# EAGLE design adc_small (EAGLE 5.11)
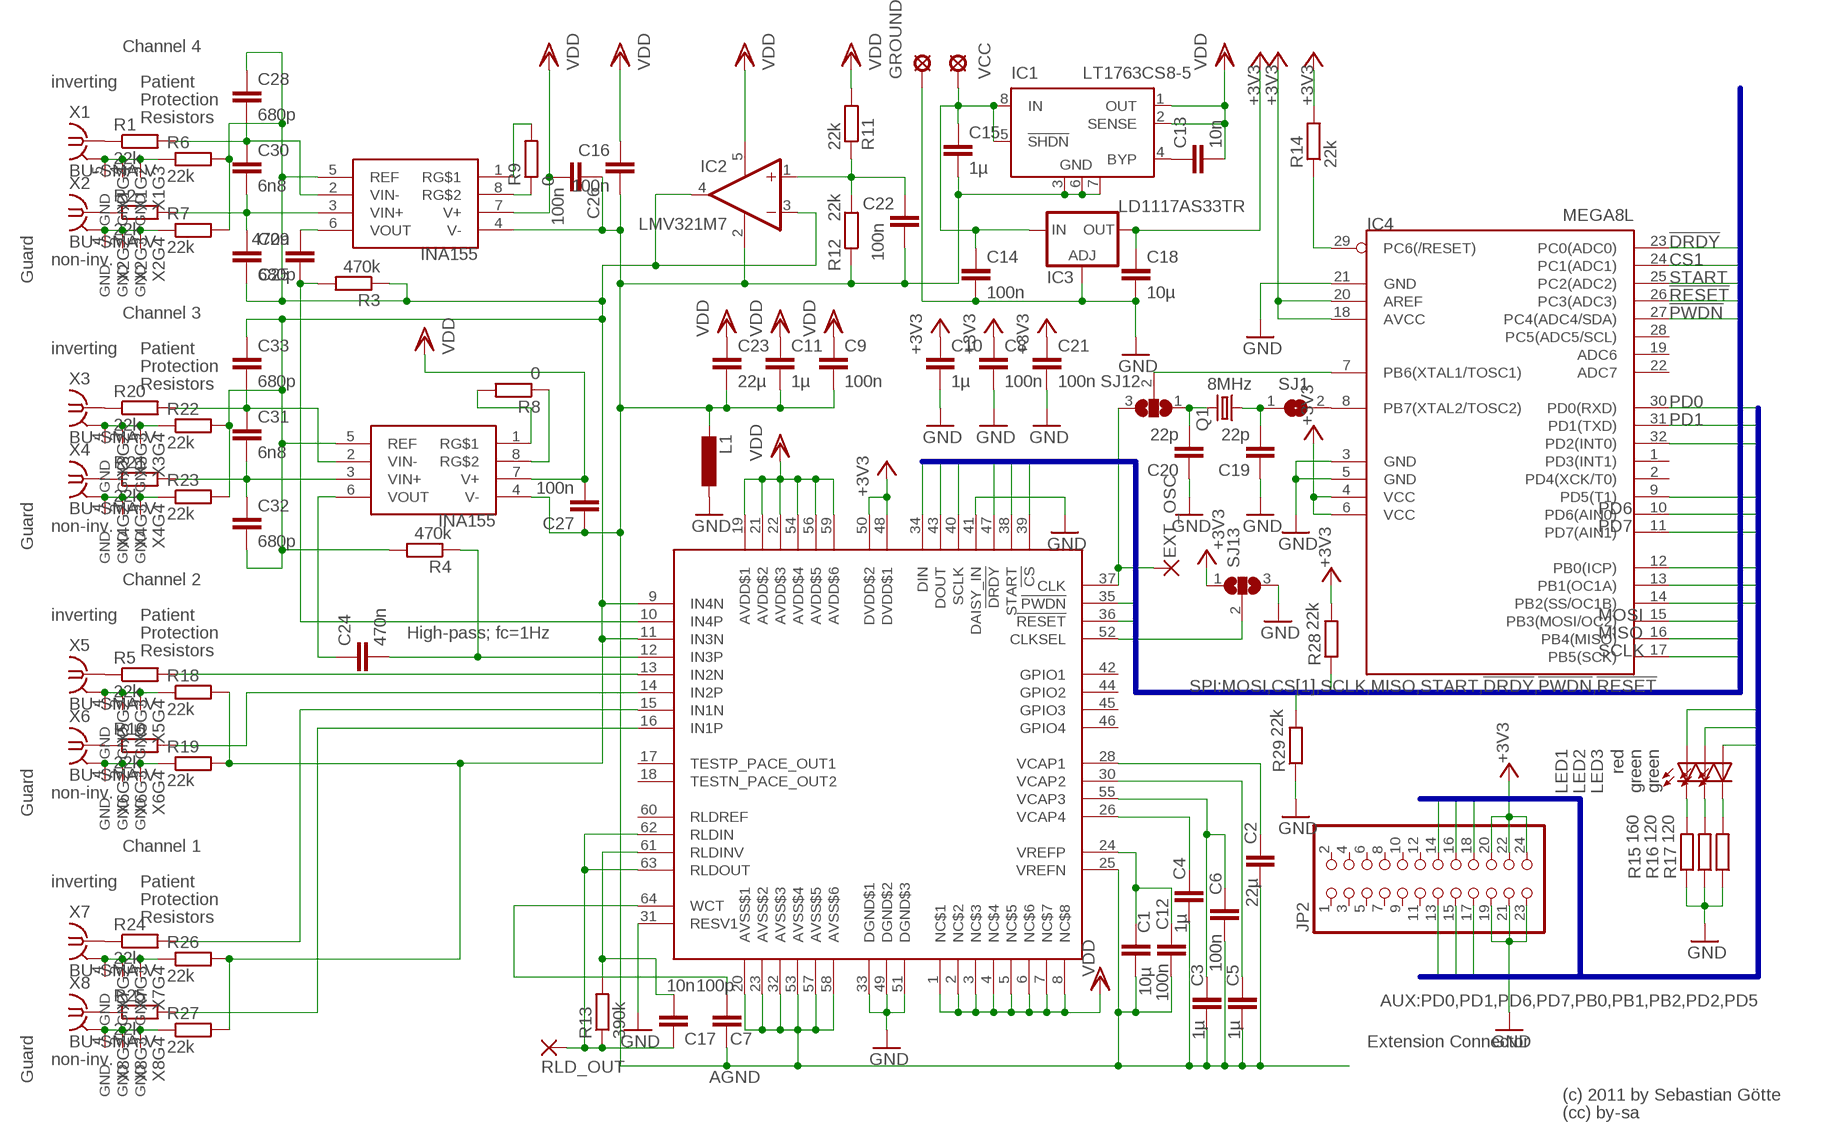
[diagram p0: schematic, sheet 1]

## Parts
C1  10µ  C-EUC0805K  [C0805K]
C2  22µ  C-EUC1206  [C1206]
C3  1µ  C-EUC0805K  [C0805K]
C4  1µ  C-EUC0805K  [C0805K]
C5  1µ  C-EUC0805K  [C0805K]
C6  100n  C-EUC0805K  [C0805K]
C7  100p  C-EUC0805K  [C0805K]
C8  100n  C-EUC0805K  [C0805K]
C9  100n  C-EUC0805K  [C0805K]
C10  1µ  C-EUC0805  [C0805]
C11  1µ  C-EUC0805K  [C0805K]
C12  100n  C-EUC0805K  [C0805K]
C13  10n  C-EUC0805K  [C0805K]
C14  100n  C-EUC0805K  [C0805K]
C15  1µ  C-EUC0805K  [C0805K]
C16  100n  C-EUC0805  [C0805]
C17  10n  C-EUC0805K  [C0805K]
C18  10µ  C-EUC0805K  [C0805K]
C19  22p  C-EUC0805K  [C0805K]
C20  22p  C-EUC0805K  [C0805K]
C21  100n  C-EUC0805K  [C0805K]
C22  100n  C-EUC0805  [C0805]
C23  22µ  C-EUC1206  [C1206]
C24  470n  C-EUC0805K  [C0805K]
C25  470n  C-EUC0805K  [C0805K]
C26  100n  C-EUC0805K  [C0805K]
C27  100n  C-EUC0805K  [C0805K]
C28  680p  C-EUC0805  [C0805]
C29  680p  C-EUC0805  [C0805]
C30  6n8  C-EUC0805  [C0805]
C31  6n8  C-EUC0805  [C0805]
C32  680p  C-EUC0805  [C0805]
C33  680p  C-EUC0805  [C0805]
EXT_OSC  1,6/0,8  [1,6/0,8]
GROUND  MCS10B  [MCS10B]
IC1  LT1763CS8-5  LT1763CS8-3.3  [SOIC8]
IC2  LMV321M7  [SC70-5L]
IC3  LD1117AS33TR  LD117AS33TR  [SOT223]
IC4  MEGA8L  MEGA8-AI  [TQFP32-08]
JP2  PINHD-2X12  [2X12]
L1  L-EUPIS2816  [PIS2816]
LED1  red  LEDCHIPLED_1206  [CHIPLED_1206]
LED2  green  LEDCHIPLED_1206  [CHIPLED_1206]
LED3  green  LEDCHIPLED_1206  [CHIPLED_1206]
Q1  8MHz  CRYSTALHC49UP  [HC49UP]
R1  22k  R-EU_R1206  [R1206]
R2  22k  R-EU_R1206  [R1206]
R3  470k  R-EU_R1206  [R1206]
R4  470k  R-EU_R1206  [R1206]
R5  22k  R-EU_R1206  [R1206]
R6  22k  R-EU_R1206  [R1206]
R7  22k  R-EU_R1206  [R1206]
R8  0  R-EU_R1206  [R1206]
R9  0  R-EU_R1206  [R1206]
R10  22k  R-EU_R1206  [R1206]
R11  22k  R-EU_R1206  [R1206]
R12  22k  R-EU_R1206  [R1206]
R13  390k  R-EU_M0805  [M0805]
R14  22k  R-EU_R1206  [R1206]
R15  160  R-EU_R1206  [R1206]
R16  120  R-EU_R1206  [R1206]
R17  120  R-EU_R1206  [R1206]
R18  22k  R-EU_R1206  [R1206]
R19  22k  R-EU_R1206  [R1206]
R20  22k  R-EU_R1206  [R1206]
R21  22k  R-EU_R1206  [R1206]
R22  22k  R-EU_R1206  [R1206]
R23  22k  R-EU_R1206  [R1206]
R24  22k  R-EU_R1206  [R1206]
R25  22k  R-EU_R1206  [R1206]
R26  22k  R-EU_R1206  [R1206]
R27  22k  R-EU_R1206  [R1206]
R28  22k  R-EU_R1206  [R1206]
R29  22k  R-EU_R1206  [R1206]
RLD_OUT  2,54/1,0  [2,54/1,0]
SJ1  SJ  [SJ]
SJ12  SJ2W  [SJ_2]
SJ13  SJ2W  [SJ_2]
U$1  ADS1194  [TQFP-64]
U$2  INA155  [SO-08]
U$3  INA155  [SO-08]
VCC  MCS10B  [MCS10B]
X1  BU-SMA-V  [BU-SMA-V]
X2  BU-SMA-V  [BU-SMA-V]
X3  BU-SMA-V  [BU-SMA-V]
X4  BU-SMA-V  [BU-SMA-V]
X5  BU-SMA-V  [BU-SMA-V]
X6  BU-SMA-V  [BU-SMA-V]
X7  BU-SMA-V  [BU-SMA-V]
X8  BU-SMA-V  [BU-SMA-V]

## Nets
!DRDY: IC4.23(PC0(ADC0)) U$1.47(!DRDY)
!PWDN: IC4.27(PC4(ADC4/SDA)) U$1.35(!PWDN)
!RESET: IC4.26(PC3(ADC3)) R29.2 U$1.36(!RESET)
+3V3: C8.1 C10.1 C18.1 C21.1 IC3.4(OUT) IC4.4(VCC) IC4.6(VCC) IC4.18(AVCC) IC4.20(AREF) JP2.20 JP2.22 JP2.24 R14.2 R28.2 SJ13.1 U$1.48(DVDD$1) U$1.50(DVDD$2)
CLK: EXT_OSC.1(P) SJ12.3 U$1.37(CLK)
CLKSEL: SJ13.2 U$1.52(CLKSEL)
CS1: IC4.24(PC1(ADC1)) R28.1 U$1.39(!CS)
MISO: IC4.16(PB4(MISO)) U$1.43(DOUT)
MOSI: IC4.15(PB3(MOSI/OC2)) U$1.34(DIN)
N$1: C2.1 U$1.28(VCAP1)
N$2: C4.1 U$1.26(VCAP4)
N$3: C7.2 U$1.64(WCT)
N$4: C5.1 U$1.30(VCAP2)
N$5: C3.1 C6.1 U$1.55(VCAP3)
N$6: C1.1 C12.1 U$1.24(VREFP)
N$7: R9.1 U$2.8(RG$2)
N$9: C25.1 R3.2 U$1.10(IN4P)
N$10: C28.1 C29.2 C32.2 C33.1 IC2.3(-IN) IC2.4(OUT) R3.1 R4.2 R6.2 R7.2 R18.2 R19.2 R22.2 R23.2 R26.2 R27.2 U$1.9(IN4N) U$1.11(IN3N) U$2.5(REF) U$3.5(REF)
N$11: R5.2 U$1.13(IN2N)
N$12: C29.1 C30.2 R2.2 U$2.3(VIN+)
N$13: C28.2 C30.1 R1.2 U$2.2(VIN-)
N$14: R1.1 X1.1
N$15: R2.1 X2.1
N$16: C13.1 IC1.4(BYP)
N$17: R20.1 X3.1
N$18: R21.1 X4.1
N$19: R9.2 U$2.1(RG$1)
N$20: R8.1 U$3.8(RG$2)
N$21: R19.1 X6.2(GND) X6.3(GND) X6.4(GND) X6.5(GND)
N$22: R18.1 X5.2(GND) X5.3(GND) X5.4(GND) X5.5(GND)
N$23: R5.1 X5.1
N$24: R10.2 U$1.14(IN2P)
N$25: R8.2 U$3.1(RG$1)
N$26: C24.1 U$3.6(VOUT)
N$27: R10.1 X6.1
N$28: C31.1 C33.2 R20.2 U$3.2(VIN-)
N$29: C31.2 C32.1 R21.2 U$3.3(VIN+)
N$30: R7.1 X2.2(GND) X2.3(GND) X2.4(GND) X2.5(GND)
N$31: R6.1 X1.2(GND) X1.3(GND) X1.4(GND) X1.5(GND)
N$32: C24.2 R4.1 U$1.12(IN3P)
N$33: C1.2 C2.2 C3.2 C4.2 C5.2 C6.2 C7.1 C9.2 C11.2 C12.2 C15.2 C16.2 C22.2 C23.2 C26.1 C27.1 IC1.3(GND) IC1.6(GND) IC1.7(GND) IC2.2(V-) L1.2 R12.1 U$1.20(AVSS$1) U$1.23(AVSS$2) U$1.25(VREFN) U$1.32(AVSS$3) U$1.53(AVSS$4) U$1.57(AVSS$5) U$1.58(AVSS$6) U$2.4(V-) U$3.4(V-)
N$34: C17.2 R13.2 U$1.61(RLDINV)
N$35: C20.2 Q1.2 SJ12.1
N$36: R24.2 U$1.15(IN1N)
N$37: R25.2 U$1.16(IN1P)
N$38: C19.2 Q1.1 SJ1.1
N$39: C8.2 C10.2 C14.2 C18.2 C19.1 C20.1 C21.2 GROUND.MP IC3.1(ADJ) IC4.3(GND) IC4.5(GND) IC4.21(GND) JP2.19 JP2.21 JP2.23 L1.1 R15.1 R16.1 R17.1 R29.1 SJ13.3 U$1.31(RESV1) U$1.33(DGND$1) U$1.41(DAISY_IN) U$1.49(DGND$2) U$1.51(DGND$3) ; supply symbol labelled GND
N$40: IC4.7(PB6(XTAL1/TOSC1)) SJ12.2
N$44: LED1.C R15.2
N$45: LED2.C R16.2
N$46: LED3.C R17.2
N$48: IC4.8(PB7(XTAL2/TOSC2)) SJ1.2
N$57: C25.2 U$2.6(VOUT)
N$58: R23.1 X4.2(GND) X4.3(GND) X4.4(GND) X4.5(GND)
N$59: R22.1 X3.2(GND) X3.3(GND) X3.4(GND) X3.5(GND)
N$60: R24.1 X7.1
N$63: R25.1 X8.1
N$65: R27.1 X8.2(GND) X8.3(GND) X8.4(GND) X8.5(GND)
N$66: R26.1 X7.2(GND) X7.3(GND) X7.4(GND) X7.5(GND)
PB0: IC4.12(PB0(ICP)) LED1.A
PB1: IC4.13(PB1(OC1A)) LED3.A
PB2: IC4.14(PB2(SS/OC1B)) LED2.A
PD0: IC4.30(PD0(RXD)) JP2.16
PD1: IC4.31(PD1(TXD)) JP2.17
PD2: IC4.32(PD2(INT0)) JP2.18
PD5: IC4.9(PD5(T1)) JP2.15
PD6: IC4.10(PD6(AIN0)) JP2.14
PD7: IC4.11(PD7(AIN1)) JP2.13
REF_NODE: C22.1 IC2.1(+IN) R11.1 R12.2
RLD_OUT: C17.1 R13.1 RLD_OUT.1(P) U$1.62(RLDIN) U$1.63(RLDOUT)
SCLK: IC4.17(PB5(SCK)) U$1.40(SCLK)
START: IC4.25(PC2(ADC2)) U$1.38(START)
UCRESET: IC4.29(PC6(/RESET)) R14.1
VCC_IN: C14.1 C15.1 IC1.5(!SHDN) IC1.8(IN) IC3.3(IN) VCC.MP
VDD: C9.1 C11.1 C13.2 C16.1 C23.1 C26.2 C27.2 IC1.1(OUT) IC1.2(SENSE) IC2.5(V+) R11.2 U$1.1(NC$1) U$1.2(NC$2) U$1.3(NC$3) U$1.4(NC$4) U$1.5(NC$5) U$1.6(NC$6) U$1.7(NC$7) U$1.8(NC$8) U$1.19(AVDD$1) U$1.21(AVDD$2) U$1.22(AVDD$3) U$1.54(AVDD$4) U$1.56(AVDD$5) U$1.59(AVDD$6) U$2.7(V+) U$3.7(V+)
Unconnected: IC4.1(PD3(INT1)) IC4.2(PD4(XCK/T0)) IC4.19(ADC6) IC4.22(ADC7) IC4.28(PC5(ADC5/SCL)) JP2.1 JP2.2 JP2.3 JP2.4 JP2.5 JP2.6 JP2.7 JP2.8 JP2.9 JP2.10 JP2.11 JP2.12 U$1.17(TESTP_PACE_OUT1) U$1.18(TESTN_PACE_OUT2) U$1.42(GPIO1) U$1.44(GPIO2) U$1.45(GPIO3) U$1.46(GPIO4) U$1.60(RLDREF)

## Buses
SPI:MOSI,CS[1],SCLK,MISO,START,!DRDY,!PWDN,!RESET
AUX:PD0,PD1,PD6,PD7,PB0,PB1,PB2,PD2,PD5

## Notes on the sheet
- Channel 4
- inverting | Patient
- Protection
- Resistors
- INA155
- non-inv.
- Guard
- Channel 3
- inverting | Patient
- Protection
- Resistors
- INA155
- non-inv.
- Guard
- Channel 2
- inverting | Patient
- Protection | High-pass; fc=1Hz
- Resistors
- non-inv.
- Guard
- Channel 1
- inverting | Patient
- Protection
- Resistors
- Extension Connector
- non-inv.
- Guard | AGND
- (c) 2011 by Sebastian Götte
- (cc) by-sa

## Library data of the parts
C1-C33 = rcl:C-EU: CAPACITOR, European symbol
EXT_OSC = wirepad:1,6/0,8: THROUGH-HOLE PAD
GROUND VCC = solpad:MCS10B: SOLDER PAD MC S1, distributor Buerklin, 15F505
IC1 = linear-technology:LT1763CS8: 500mA, Low Noise, LDO Micropower Regulators Source: http://cds.linear.com/docs/Datasheet/1763ff.pdf; MPN: LT1763CS8-3.3; OC_FARNELL: 1273617; OC_NEWARK: 57M6055
IC2 = linear:LMV321?*: General Purpose, Low Voltage, Rail-to-Rail Output Operational Amplifiers Source: http://www.national.com/mpf/LM/LMV321.html http://www.national.com/dt/lmv_qual.pdf
IC3 = v-reg:LD117A?*: Low drop fixed and adjustable positive voltage regulators 1 A Source: http://www.st.com/stonline/products/literature/ds/7194/ld1117axx.pdf
IC4 = atmel:MEGA8: MICROCONTROLLER 8 Kbytes FLASH, 1 kbytes SRAM, 512 bytes EEPROM, USART, 6-channel 10 bit ADC, 2-channel 8 bit ADC Pin compatible with Atmega48, ATMega88, ATMega168 Source: avr.lbr; MPN: ATMEGA8-16AU; OC_FARNELL: 9171371; OC_NEWARK: 73M8863
JP2 = pinhead:PINHD-2X12: PIN HEADER
L1 = rcl:L-EU: INDUCTOR, European symbol
LED1-LED3 = led:LED: LED OSRAM: - CHIPLED LG R971, LG N971, LY N971, LG Q971, LY Q971, LO R971, LY R971 LH N974, LH R974 LS Q976, LO Q976, LY Q976 LO Q996 - Hyper CHIPLED LW Q18S LB Q993, LB Q99A, LB R99A - SideLED LS A670, LO A670, LY A670, LG A670, LP A670 LB A673, LV A673, LT A673, LW A673 LH A674 LY A675 LS A676, LA A676, LO A676, LY A676, LW A676 LS A679, LY A679, LG A679 - Hyper Micro SIDELED® LS Y876, LA Y876, LO Y876, LY Y876 LT Y87S - SmartLED LW L88C, LW L88S LB L89C, LB L89S, LG L890 LS L89K, LO L89K, LY L89K LS L896, LA L896, LO L896, LY L896 - TOPLED LS T670, LO T670, LY T670, LG T670, LP T670 LSG T670, LSP T670, LSY T670, LOP T670, LYG T670 LG T671, LOG T671, LSG T671 LB T673, LV T673, LT T673, LW T673 LH T674 LS T676, LA T676, LO T676, LY T676, LB T676, LH T676, LSB T676, LW T676 LB T67C, LV T67C, LT T67C, LS T67K, LO T67K, LY T67K, LW E67C LS E67B, LA E67B, LO E67B, LY E67B, LB E67C, LV E67C, LT E67C LW T67C LS T679, LY T679, LG T679 LS T770, LO T770, LY T770, LG T770, LP T770 LB T773, LV T773, LT T773, LW T773 LH T774 LS E675, LA E675, LY E675, LS T675 LS T776, LA T776, LO T776, LY T776, LB T776 LHGB T686 LT T68C, LB T68C - Hyper Mini TOPLED® LB M676 - Mini TOPLED Santana® LG M470 LS M47K, LO M47K, LY M47K Source: http://www.osram.convergy.de LUXEON: - LUMILED® LXK2-PW12-R00, LXK2-PW12-S00, LXK2-PW14-U00, LXK2-PW14-V00 LXK2-PM12-R00, LXK2-PM12-S00, LXK2-PM14-U00 LXK2-PE12-Q00, LXK2-PE12-R00, LXK2-PE12-S00, LXK2-PE14-T00, LXK2-PE14-U00 LXK2-PB12-K00, LXK2-PB12-L00, LXK2-PB12-M00, LXK2-PB14-N00, LXK2-PB14-P00, LXK2-PB14-Q00 LXK2-PR12-L00, LXK2-PR12-M00, LXK2-PR14-Q00, LXK2-PR14-R00 LXK2-PD12-Q00, LXK2-PD12-R00, LXK2-PD12-S00 LXK2-PH12-R00, LXK2-PH12-S00 LXK2-PL12-P00, LXK2-PL12-Q00, LXK2-PL12-R00 Source: www.luxeon.com KINGBRIGHT: KA-3528ASYC Source: www.kingbright.com
Q1 = crystal:CRYSTAL: CRYSTAL; OC_FARNELL: unknown; OC_NEWARK: unknown
R1-R29 = rcl:R-EU_: RESISTOR, European symbol
RLD_OUT = wirepad:2,54/1,0: THROUGH-HOLE PAD
SJ1 = jumper:SJ: SMD solder JUMPER
SJ12 SJ13 = jumper:SJ2W: SMD solder JUMPER
U$1 = mytexas:ADS1194: Low-Power, 8-Channel, 16-Bit Analog Front-End for Biopotential Measurements for ECG/EEG applications
U$2 U$3 = mytexas:INA155: Single-Supply, Rail-to-Rail Output, CMOS INSTRUMENTATION AMPLIFIER
X1-X8 = con-coax:BU-SMA-V: FEMALE SMA CONNECTOR Radiall distributor RS 112-3794; OC_FARNELL: unknown; OC_NEWARK: unknown

## Board
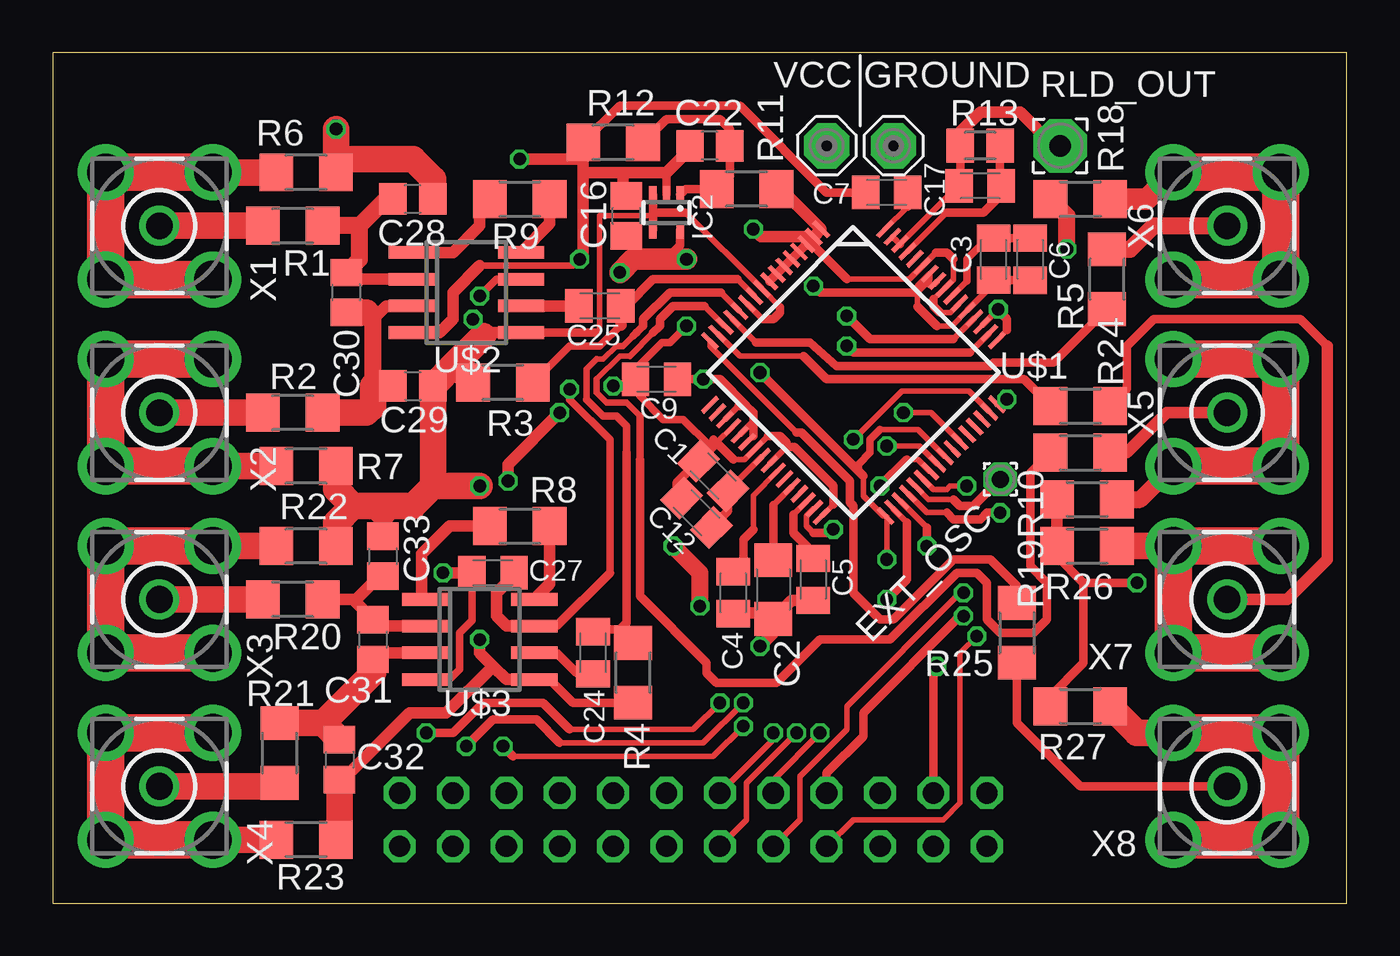
[diagram p1: board, top side]
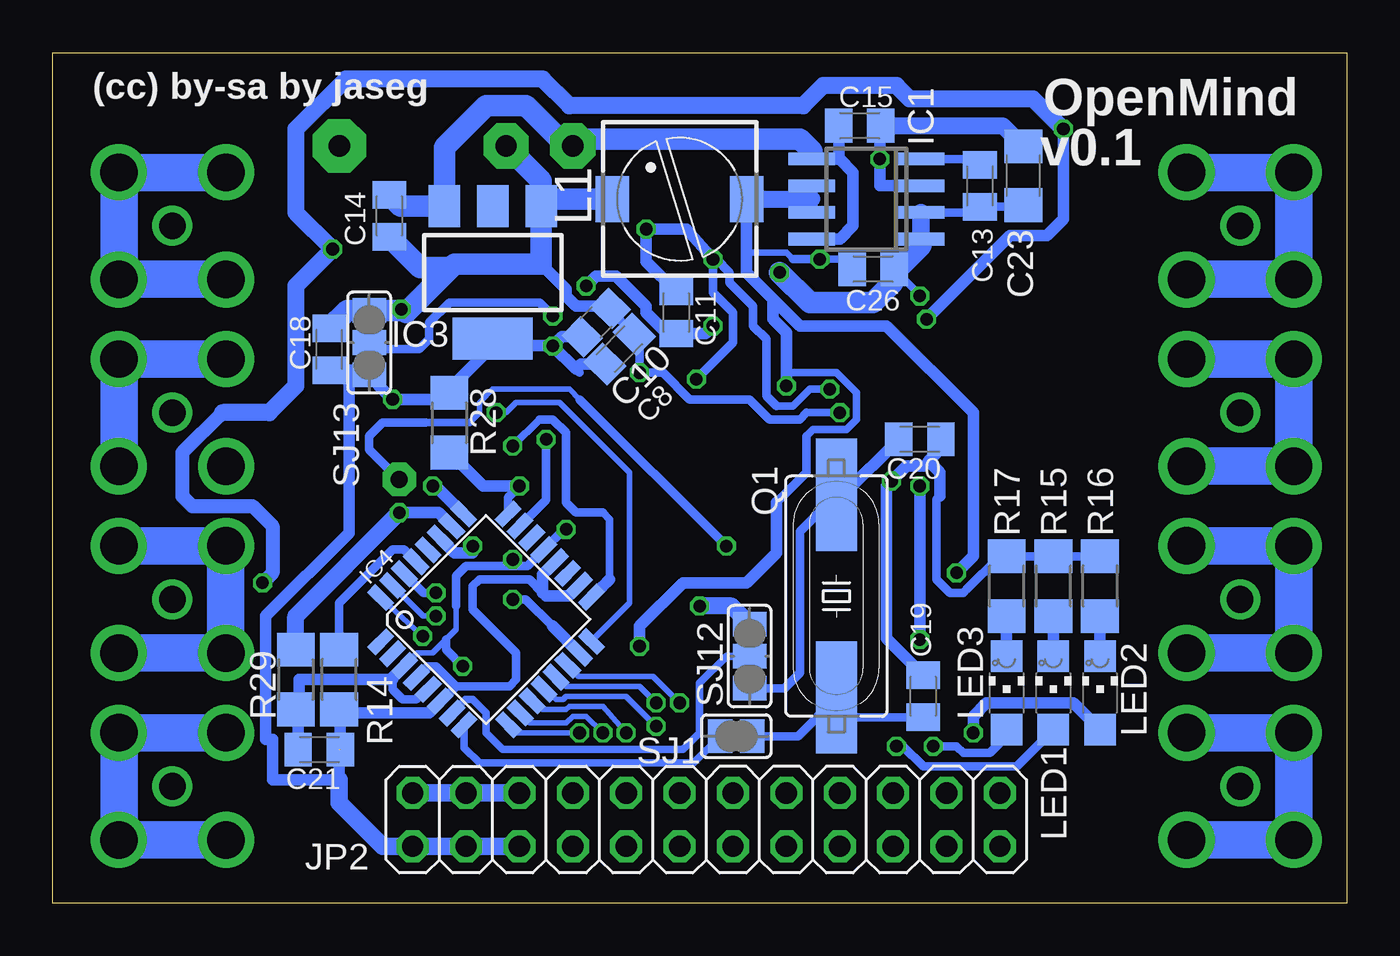
[diagram p2: board, bottom side, seen from below]

Size 61.58 x 40.47 mm. Coordinates in mm from the lower left corner, seen from the top.
Outline: 0,0 61.58,0 61.58,40.47 0,40.47 0,0
Copper layers (1*16): Top 0.035mm / dielectric 1.5mm / Bottom 0.035mm
Design rules "Fusion_eagle_rule_v1.1": minimum track width 6mil, minimum drill 12mil, track to track 6mil, track to pad 6mil, pad to pad 6mil, via to via 6mil, smd to smd 0mil, copper to edge 10mil, drill to drill 10mil, minimum pad ring 10mil, minimum via ring 6mil, stop-mask expansion 2mil, vias tented up to drill 100mil, thermal gap 10mil

### Footprints (pad centres in the part's own frame; a part is rotated, then mirrored left to right if it is on the bottom)
C0805K = smd 1.3 x 1.6: 1 -1,0; 2 1,0
C1206 = smd 1.6 x 1.8: 1 -1.4,0; 2 1.4,0
C0805 = smd 1.3 x 1.5: 1 -0.95,0; 2 0.95,0
1,6/0,8 = drill 0.813 pad 1.6 octagon: 1 0,0
MCS10B = drill 1.016 pad 2.159 octagon: MP 0,0
SOIC8 = smd 0.6 x 2.2: 1 -1.905,-2.6; 2 -0.635,-2.6; 3 0.635,-2.6; 4 1.905,-2.6; 5 1.905,2.6; 6 0.635,2.6; 7 -0.635,2.6; 8 -1.905,2.6
SC70-5L = smd 0.35 x 0.8: 1 -0.65,-0.85; 2 0,-0.85; 3 0.65,-0.85; 4 0.65,0.85; 5 -0.65,0.85
SOT223 = smd 1.5 x 2: 1 -2.3,-3.15; 2 0,-3.15; 3 2.3,-3.15 | smd 3.8 x 2: 4 0,3.15
TQFP32-08 = smd 1.27 x 0.559: 1 -4.293,2.8; 2 -4.293,2; 3 -4.293,1.2; 4 -4.293,0.4; 5 -4.293,-0.4; 6 -4.293,-1.2; 7 -4.293,-2; 8 -4.293,-2.8; 17 4.293,-2.8; 18 4.293,-2; 19 4.293,-1.2; 20 4.293,-0.4; 21 4.293,0.4; 22 4.293,1.2; 23 4.293,2; 24 4.293,2.8 | smd 0.559 x 1.27: 9 -2.8,-4.293; 10 -2,-4.293; 11 -1.2,-4.293; 12 -0.4,-4.293; 13 0.4,-4.293; 14 1.2,-4.293; 15 2,-4.293; 16 2.8,-4.293; 25 2.8,4.293; 26 2,4.293; 27 1.2,4.293; 28 0.4,4.293; 29 -0.4,4.293; 30 -1.2,4.293; 31 -2,4.293; 32 -2.8,4.293
2X12 = drill 1.016 octagon: 1 -13.97,-1.27; 2 -13.97,1.27; 3 -11.43,-1.27; 4 -11.43,1.27; 5 -8.89,-1.27; 6 -8.89,1.27; 7 -6.35,-1.27; 8 -6.35,1.27; 9 -3.81,-1.27; 10 -3.81,1.27; 11 -1.27,-1.27; 12 -1.27,1.27; 13 1.27,-1.27; 14 1.27,1.27; 15 3.81,-1.27; 16 3.81,1.27; 17 6.35,-1.27; 18 6.35,1.27; 19 8.89,-1.27; 20 8.89,1.27; 21 11.43,-1.27; 22 11.43,1.27; 23 13.97,-1.27; 24 13.97,1.27
PIS2816 = smd 2.2 x 1.6: 1 0,3.2; 2 0,-3.2
CHIPLED_1206 = smd 1.5 x 1.5: A 0,-1.75; C 0,1.75
HC49UP = smd 5.334 x 1.93: 1 -4.826,0; 2 4.826,0
R1206 = smd 1.6 x 1.803: 1 -1.422,0; 2 1.422,0
M0805 = smd 1.3 x 1.6: 1 -0.95,0; 2 0.95,0
2,54/1,0 = drill 1.016 pad 2.54 octagon: 1 0,0
SJ = smd 1.168 x 1.6: 1 -0.762,0; 2 0.762,0
SJ_2 = smd 1.168 x 1.6: 1 -1.524,0; 2 0,0; 3 1.524,0
TQFP-64 = smd 1 x 0.22: 1 -5.9,3.75; 2 -5.9,3.25; 3 -5.9,2.75; 4 -5.9,2.25; 5 -5.9,1.75; 6 -5.9,1.25; 7 -5.9,0.75; 8 -5.9,0.25; 9 -5.9,-0.25; 10 -5.9,-0.75; 11 -5.9,-1.25; 12 -5.9,-1.75; 13 -5.9,-2.25; 14 -5.9,-2.75; 15 -5.9,-3.25; 16 -5.9,-3.75; 33 5.9,-3.75; 34 5.9,-3.25; 35 5.9,-2.75; 36 5.9,-2.25; 37 5.9,-1.75; 38 5.9,-1.25; 39 5.9,-0.75; 40 5.9,-0.25; 41 5.9,0.25; 42 5.9,0.75; 43 5.9,1.25; 44 5.9,1.75; 45 5.9,2.25; 46 5.9,2.75; 47 5.9,3.25; 48 5.9,3.75 | smd 0.22 x 1: 17 -3.75,-5.9; 18 -3.25,-5.9; 19 -2.75,-5.9; 20 -2.25,-5.9; 21 -1.75,-5.9; 22 -1.25,-5.9; 23 -0.75,-5.9; 24 -0.25,-5.9; 25 0.25,-5.9; 26 0.75,-5.9; 27 1.25,-5.9; 28 1.75,-5.9; 29 2.25,-5.9; 30 2.75,-5.9; 31 3.25,-5.9; 32 3.75,-5.9; 49 3.75,5.9; 50 3.25,5.9; 51 2.75,5.9; 52 2.25,5.9; 53 1.75,5.9; 54 1.25,5.9; 55 0.75,5.9; 56 0.25,5.9; 57 -0.25,5.9; 58 -0.75,5.9; 59 -1.25,5.9; 60 -1.75,5.9; 61 -2.25,5.9; 62 -2.75,5.9; 63 -3.25,5.9; 64 -3.75,5.9
SO-08 = smd 0.6 x 2.2: 1 -1.905,-2.6; 2 -0.635,-2.6; 3 0.635,-2.6; 4 1.905,-2.6; 5 1.905,2.6; 6 0.635,2.6; 7 -0.635,2.6; 8 -1.905,2.6
BU-SMA-V = drill 1.27 round: 1 0,0 | drill 1.778 round: 2 -2.55,2.55; 3 2.55,2.55; 4 2.55,-2.55; 5 -2.55,-2.55

### Placement (x,y rotation side)
C1  31.43,20.32 135 top
C2  34.29,14.92 270 top
C3  44.77,30.64 270 top
C4  32.38,14.76 270 top
C5  36.2,15.4 270 top
C6  46.51,30.64 270 top
C7  39.69,33.81 0 top
C8  34.61,26.35 45.4 bottom
C9  28.73,24.92 180 top
C10  35.72,27.62 45.3 bottom
C11  31.91,28.1 270 bottom
C12  30.64,18.57 135 top
C13  17.46,34.13 270 bottom
C14  45.56,32.7 270 bottom
C15  23.18,36.99 0 bottom
C16  27.3,32.7 90 top
C17  44.13,34.13 0 top
C18  48.42,26.35 90 bottom
C19  20.16,9.84 270 bottom
C20  20.32,22.07 180 bottom
C21  48.9,7.3 180 bottom
C22  31.27,36.04 180 top
C23  15.4,34.61 90 bottom
C24  25.72,11.91 90 top
C25  26.04,28.42 180 top
C26  22.54,30.16 0 bottom
C27  20.95,15.72 0 top
C28  17.14,33.5 180 top
C29  17.14,24.61 0 top
C30  13.97,29.05 270 top
C31  15.24,12.54 270 top
C32  13.65,6.83 270 top
C33  15.72,16.51 270 top
EXT_OSC  45.09,20.16 0 top
GROUND  40.01,36.04 0 top
IC1  22.86,33.5 90 bottom
IC2  29.21,32.86 180 top
IC3  40.64,30 180 bottom
IC4  40.96,13.49 45.1 bottom
JP2  30.48,3.97 180 bottom
L1  31.75,33.5 90 bottom
LED1  13.97,10 0 bottom
LED2  11.75,10 0 bottom
LED3  16.19,10 0 bottom
Q1  24.29,14.61 90 bottom
R1  11.43,32.23 0 top
R2  11.43,23.34 0 top
R3  21.43,24.77 0 top
R4  27.62,10.95 270 top
R5  50.16,29.69 270 top
R6  12.06,34.77 0 top
R7  12.06,20.8 0 top
R8  22.23,17.94 180 top
R9  22.23,33.5 180 top
R10  48.9,21.43 180 top
R11  33.02,33.97 0 top
R12  26.67,36.2 0 top
R13  44.13,36.04 0 top
R14  47.94,10.64 270 bottom
R15  13.97,15.08 270 bottom
R16  11.75,15.08 270 bottom
R17  16.19,15.08 270 bottom
R18  48.9,33.5 180 top
R19  49.21,19.21 180 top
R20  11.43,14.45 0 top
R21  10.79,7.14 90 top
R22  12.06,16.99 0 top
R23  12.06,3.02 0 top
R24  48.9,23.65 180 top
R25  45.88,12.86 90 top
R26  49.21,16.99 180 top
R27  48.9,9.37 180 top
R28  42.7,22.86 90 bottom
R29  50.01,10.64 90 bottom
RLD_OUT  47.94,36.04 0 top
SJ1  29.05,7.94 180 bottom
SJ12  28.42,11.75 90 bottom
SJ13  46.51,26.67 90 bottom
U$1  38.1,25.24 315.1 top
U$2  19.68,29.05 270 top
U$3  20.32,12.54 270 top
VCC  36.83,36.04 0 top
X1  5.08,32.23 90 top
X2  5.08,23.34 90 top
X3  5.08,14.45 90 top
X4  5.08,5.56 90 top
X5  55.88,32.23 180 top
X6  55.88,23.34 0 top
X7  55.88,14.45 0 top
X8  55.88,5.56 0 top

### Tracks (layer width: path | path; a pad name or v marks a point on that pad's centre or on a via)
!DRDY  (via drill 0.6)
  Top 0.254: U$1.47 43.59,24.37 40.4,24.37 v38.1,22.07
  Bottom 0.406: v38.1,22.07 38.1,19.19 IC4.23
!PWDN  (via drill 0.6)
  Top 0.254: 41.59,17.87 U$1.35
  Top 0.406: v41.59,16.99 41.59,17.87
  Bottom 0.559: v41.59,16.99 41.59,16.67 42.45,16.67 IC4.27
!RESET  (via drill 0.6)
  Top 0.254: U$1.36 41.6,18.57 42.55,18.57
  Top 0.406: 42.55,18.57 42.86,18.26 44.13,18.26 44.45,18.57 v45.09,18.57
  Bottom 0.559: IC4.26 43.22,18.57 v45.09,18.57
  Bottom 0.813: v45.09,18.57 50.01,13.65 R29.2
+3V3  (via drill 0.6)  (1 unrouted)
  Top 0.254: U$1.48 45.16,23.73 v45.4,23.97 | 43.63,26.19 U$1.50
  Top 0.406: v37.78,26.51 38.1,26.19 43.63,26.19
  Bottom 0.254: 47.78,9.05 R14.2 | IC4.6 43.14,9.57
  Bottom 0.356: R28.2 42.86,24.29
  Bottom 0.406: 37.81,26.54 v37.78,26.51 | 38.1,14.61 38.26,14.76 38.89,15.4 41.27,15.4 41.59,15.08 41.59,13.97 39.53,11.91 39.53,10.64 39.85,10.32 42.39,10.32 | 38.1,14.61 | 41.21,26.76 41.12,26.67 40.77,26.67 IC3.4 | IC3.4 40.32,26.54 | 43.18,23.97 42.86,24.29 | 40.96,26.19 40.96,26.54 IC3.4 | SJ13.1 46.72,25.35 46.78,25.35 | 36.67,25.4 36.51,25.24 | 42.39,10.32 43.1,9.61 IC4.6 | IC4.4 43.73,11.27 43.34,11.27 42.39,10.32
  Bottom 0.559: IC4.20 38.26,15.64 38.26,14.76 | IC4.18 37.03,14.61 38.1,14.61 | 40.32,26.54 37.81,26.54 | 43.18,23.97 v45.4,23.97 46.78,25.35 47.47,25.35 | 42.86,24.29 40.96,26.19 | 47.47,25.35 C18.1 | 47.78,9.05 43.66,9.05 43.14,9.57 | C10.1 37.35,26.95 v37.78,26.51 36.67,25.4 36.43,25.64 C8.1 | C21.1 47.9,9.17 R14.2 | 47.94,7.3 47.94,5.87 51.12,5.87 51.12,7.78 51.44,7.78 51.44,13.65 47.47,17.62 47.47,25.35
  Bottom 0.838: JP2.20 JP2.22 JP2.24 45.88,2.7 47.94,4.76 47.94,5.87
CLK  (via drill 0.6)
  Top 0.254: U$1.37 41.67,19.21 42.86,19.21
  Top 0.406: 42.86,19.21 43.18,18.89 43.81,18.89 EXT_OSC.1
  Top 0.813: v30.8,14.13 30.8,15.72 v29.53,16.99
  Bottom 0.254: 41.75,22.86 41.27,23.34 41.27,23.81 40.64,24.45 36.99,24.45 36.51,23.97
  Bottom 0.356: 41.75,22.86 43.81,22.86
  Bottom 0.406: 43.81,22.86 45.88,22.86 46.51,22.23 46.51,21.59 EXT_OSC.1 | v29.53,16.99 36.51,23.97
  Bottom 0.813: SJ12.3 29.27,14.13 v30.8,14.13
CLKSEL  (via drill 0.6)
  Top 0.254: 42.85,26.83 U$1.52
  Top 0.406: v37.78,27.94 38.89,26.83 42.85,26.83
  Bottom 0.406: v37.78,27.94 38.42,28.57 42.7,28.57 43.66,27.62 43.66,26.83 44.13,26.35 46.2,26.35 SJ13.2
CS1  (via drill 0.6)
  Top 0.254: U$1.39 41.18,21.11 40.64,21.11
  Top 0.406: v39.37,19.84 40.64,21.11
  Bottom 0.406: v39.37,19.84 39.91,19.3 IC4.24
  Bottom 0.559: R28.1 41.11,19.84 v39.37,19.84
MISO  (via drill 0.6)
  Top 0.254: U$1.43 41.79,23.34 v40.48,23.34
  Bottom 0.254: IC4.16 35.94,12.48 34.13,14.29 34.13,20.48 37.47,23.81 39.53,23.81 40.01,23.34 v40.48,23.34
MOSI  (via drill 0.6)
  Top 0.254: 40.64,18.12 U$1.34
  Top 0.406: 40.64,18.12 40.64,15.4 v39.69,14.45
  Bottom 0.406: 37.8,13.18 39.07,14.45 v39.69,14.45
  Bottom 0.559: IC4.15 37.8,13.18
N$1
  Top 0.254: 34.29,18.94 U$1.28
  Top 0.406: C2.1 34.29,18.94
N$2
  Top 0.254: U$1.26 33.34,19.4 33.34,17.78
  Top 0.406: 33.34,17.78 32.86,17.3 32.86,16.03 32.59,15.76 C4.1
N$3
  Top 0.254: U$1.64 40.69,33.15
  Top 0.406: 40.69,33.15 C7.2
N$4
  Top 0.254: 35.24,18.48 U$1.30
  Top 0.406: C5.1 36.2,16.67 35.24,17.62 35.24,18.48
N$5
  Top 0.254: U$1.55 43.5,29.59
  Top 0.356: 43.5,29.59 43.5,30.64 44.77,31.91
  Top 0.406: C6.1 C3.1 44.77,31.91
N$6
  Top 0.254: C1.1 U$1.24
  Top 0.406: C12.1 32.14,18.66 C1.1
N$7
  Top 0.559: R9.1 23.65,32.32 U$2.8
N$9
  Top 0.254: 32.58,29.69 U$1.10
  Top 0.356: R3.2 24.6,26.51 26.04,26.51 27.04,27.51
  Top 0.406: 27.3,28.42 28.57,29.69 32.58,29.69
  Top 0.559: 27.3,28.42 C25.1 27.04,27.51
N$10  (via drill 0.6)
  Top 0.254: 33.78,27.78 U$1.11 | 34.61,28.37 U$1.9 30.11,32.86 | 25.88,27.15 26.04,27.3 26.04,32.7 28.56,32.7
  Top 0.356: 15.72,18.57 C33.1 | 19.13,25.64 19.14,25.64
  Top 0.406: 14.12,35.4 R6.2 | R23.2 13.65,3.18 | 20.64,27.15 20.48,26.99 20.48,27.31 v20,27.78 | 47.94,16.99 47.79,17.14 R26.2 47.47,16.67 47.47,16.66 | 47.94,16.99 47.79,17.31 | IC2.4 28.56,32.7 28.56,32.86 | 28.56,32.86 IC2.3 | 33.78,27.78 34.29,27.78 34.61,28.1 34.61,28.37 | 18.1,19.84 18.09,19.84 | U$3.5 23.65,10.64 24.77,9.53 26.98,9.53 R4.2 | 28.56,32.86 30.11,32.86 | U$2.5 25.88,27.15 | C32.2 13.81,5.88 | 47.94,16.99 47.78,16.83 47.78,16.51 49.05,15.24 | v51.59,15.24 49.05,15.24 | R27.2 47.47,9.84 49.05,11.43 49.05,15.24
  Top 0.559: U$3.5 21.59,10.64 20.95,11.27 | 20.64,27.15 U$2.5 | 47.79,17.31 R19.2 | 20.95,11.27 20.32,11.91 v20.32,12.54 | 13.81,5.88 16.99,9.05 18.73,9.05 20.95,11.27
  Top 0.813: v48.26,31.11 48.26,32.71 R18.2
  Top 1.27: 14.12,35.4 17.14,35.4 18.09,34.45 C28.1 | R22.2 13.49,18.09 14.29,18.89 | 15.4,18.89 17.14,18.89 18.09,19.84 C29.2 19.13,25.64 20.48,26.99 | 15.4,18.89 14.29,18.89 | R7.2 13.49,19.69 14.29,18.89 | 13.65,3.18 C32.2 | v20.32,19.84 18.1,19.84 | 15.4,18.89 15.72,18.57 | 19.14,25.64 R3.1 | v13.49,36.83 R6.2
  Bottom 0.559: v20.32,12.54 v20.32,19.84 | v20,27.78 16.03,31.75 14.29,31.75 13.49,32.54 v13.49,36.83
  Bottom 0.66: 53.5,23.34 55.4,21.43 55.4,19.37 54.93,18.89 52.07,18.89 51.12,17.94 51.12,15.72 v51.59,15.24
  Bottom 0.813: 53.5,23.34 51.28,23.34 50.01,24.61 50.01,29.37 v48.26,31.11 50.01,32.86 50.01,36.83 47.62,39.21 38.26,39.21 36.99,37.94 25.88,37.94 24.92,38.89 21.43,38.89 20.8,38.26 14.92,38.26 v13.49,36.83
N$11
  Top 0.254: U$1.13 33.47,26.67
  Top 0.406: 33.47,26.67 36.04,26.67 37.31,25.56 44.61,25.56 44.77,25.72 47.62,25.72 R5.2
N$12
  Top 0.406: 15.24,24.61 C29.1 | 15.24,27.78 14.92,28.1
  Top 0.559: 15.24,27.78 15.88,28.42 U$2.3
  Top 0.813: 15.24,24.61 15.24,27.78
  Top 1.27: R2.2 14.93,23.34 15.24,23.65 15.24,24.61 | 14.92,28.1 C30.2
N$13
  Top 0.406: 15.88,33.5 C28.2 | C30.1 14.29,29.69
  Top 0.559: 14.29,29.69 U$2.2
  Top 0.813: 14.61,32.23 R1.2 | 14.61,32.23 15.88,33.5 | C30.1 14.61,30.64 14.61,32.23
N$14
  Top 1.27: X1.1 R1.1
N$15
  Top 1.27: X2.1 R2.1
N$16
  Bottom 0.406: 20.32,35.4 IC1.4 17.73,35.4 C13.1
N$17
  Top 1.27: X3.1 R20.1
N$18
  Top 0.406: 10.63,5.56 R21.1
  Top 1.27: X4.1 10.63,5.56
N$19
  Top 0.406: 20.32,33.01 R9.2
  Top 0.559: U$2.1 19.05,30.96 20.32,32.23 20.32,33.01
N$20
  Top 0.559: R8.1 23.65,15.17 U$3.8
N$21
  Top 0.406: X6.2 53.33,25.88
  Top 0.813: X6.5 51.75,19.21 R19.1
  Top 1.778: X6.2 X6.3 X6.4 X6.5
  Bottom 1.778: X6.4 58.42,25.88 53.34,25.88 X6.2
N$22
  Top 0.406: X5.4 53.33,34.77
  Top 1.016: X5.4 52.05,33.5 R18.1
  Top 1.778: X5.3 X5.2 X5.5 X5.4
  Bottom 1.778: X5.3 X5.2 58.42,34.77 53.34,34.77 X5.4
N$23
  Top 0.813: X5.1 52.39,32.23 51.27,31.11 R5.1
N$24
  Top 0.254: 31.02,28.42 U$1.14 | 27.46,26.04 26.99,26.04 25.88,24.92
  Top 0.305: 27.46,26.04 28.57,27.15 | 25.88,24.92 25.88,24.29 26.35,23.81 27.3,23.81 27.94,23.18
  Top 0.356: 27.94,21.11 27.94,23.18
  Top 0.406: R10.2 46.51,20.47 46.51,16.03 47.31,15.24 47.31,13.49 46.67,12.86 45.09,12.86 44.45,13.49 44.45,15.24 43.97,15.72 43.02,15.72 42.07,14.76 40.8,13.49 39.85,12.54 36.51,12.54 34.45,10.48 31.59,10.48 31.11,10.95 31.11,11.43 27.94,14.61 27.94,21.11 | 31.02,28.42 29.53,28.42 28.89,27.78 28.89,27.46 28.57,27.15
N$25
  Top 0.559: R8.2 18.89,17.94 17.56,16.61 17.56,14.51 17.62,14.45 U$3.1
N$26
  Top 0.406: U$3.6 23.97,11.91 24.92,10.95 25.67,10.95 C24.1
N$27
  Top 0.559: X6.1 53.02,23.34 51.12,21.43 R10.1
N$28
  Top 0.356: 15.56,15.56 C33.2
  Top 0.406: 14.29,14.45 14.37,14.37 | C31.1 15.55,13.18
  Top 0.559: R20.2 14.29,14.45 | C31.1 14.37,14.37 15.56,15.56 | 15.55,13.18 U$3.2
N$29
  Top 0.406: 15.24,10.94 C31.2 15.55,11.91
  Top 0.559: 15.55,11.91 U$3.3
  Top 1.27: R21.2 12.86,8.57 | 12.86,8.57 C32.1 | 12.86,8.57 15.24,10.94
N$30
  Top 0.406: X2.4 7.63,25.88 | 10.63,20.79 R7.1
  Top 1.27: X2.5 10.63,20.79
  Top 1.778: X2.4 X2.3 X2.2 X2.5
  Bottom 1.778: X2.5 X2.2 2.54,25.88 7.62,25.88 X2.4
N$31
  Top 0.406: 2.53,30.32 2.54,30.32 X1.2 | X1.4 7.63,34.77
  Top 1.27: 7.63,34.77 R6.1
  Top 1.778: X1.2 X1.5 | 2.53,30.32 X1.3 X1.4
  Bottom 1.778: X1.5 X1.2 2.54,34.77 7.62,34.77 X1.4
N$32
  Top 0.254: 31.8,29.05 U$1.12 | 26.83,26.51 26.19,25.88 25.88,25.88
  Top 0.305: 25.88,25.88 25.4,25.4 25.4,23.97 | 27.78,27.15 27.15,26.51 26.83,26.51
  Top 0.356: 27.3,21.43 27.3,22.7 26.83,23.18 26.19,23.18 25.4,23.97 | 27.62,26.99 | 27.78,27.15 27.86,27.23 | 27.86,27.23 28.1,27.46 | 27.86,27.23 27.62,26.99 | 27.86,27.23
  Top 0.406: 25.61,13.33 C24.2 25.82,13.01 26.99,13.01 | 29.84,29.05 31.8,29.05 | 29.84,29.05 | 29.84,29.05 29.37,29.05 28.1,27.78 28.1,27.46 | 27.3,21.43 27.3,13.33 26.99,13.01 | R4.1 26.99,13.01 | 27.78,27.15
N$33  (via drill 0.6)
  Top 0.254: 32.38,21.11 32.93,21.11 U$1.23 34.04,22.23 | 34.92,21.7 U$1.25 | 37.15,18.97 U$1.32 | 31.59,21.9 U$1.20 | 41.21,29.43 41.15,29.37 41.15,28.38 | 41.21,29.43 U$1.58 41.73,29.67 41.12,29.05 | U$1.57 41.92,29.43 41.21,29.43 | 44.77,29.45 U$1.53 42.78,27.46 42.07,27.46
  Top 0.305: 20.32,30.32 24.77,30.32 v25.08,30.64
  Top 0.356: C27.1 19.95,13.45 19.37,12.86 19.37,11.11 18.89,10.64 U$3.4 | 31.36,21.66 31.36,21.77 31.3,21.77 31.27,21.75 30,23.02 29.05,23.02 27.94,24.13 27.94,24.77 27.89,24.77 C9.2 | v30.16,27.46 29.37,26.67 29,26.67 27.73,25.4 C9.2 | 27.42,24.61 C9.2
  Top 0.406: 25.4,36.04 R12.1 26.99,37.94 32.7,37.94 36.83,33.81 C7.1 38.73,33.77 | v25.08,30.64 25.25,30.8 | 29.21,34.77 IC2.2 | U$3.4 17.78,10.64 | 31.44,21.75 31.52,21.82 | 31.52,21.82 31.59,21.9 32.38,21.11 | 34.04,22.23 34.61,22.23 34.92,21.91 34.92,21.7 35.29,21.7 37.15,19.84 37.15,18.97 | 31.44,21.75 31.43,21.75 | 33.97,13.81 34.1,13.68 C2.2 34.29,12.86 | 32.43,13.81 C4.2 | 30.32,35.88 C22.2 | 31.44,22.06 31.44,21.9 31.52,21.82 | 31.44,21.75 31.44,21.74 31.36,21.66 C1.2 29.69,19.99 29.69,19.21 29.76,19.28 C12.2 | C6.2 C3.2 44.77,29.45 | 41.15,28.38 42.07,27.46 | 41.12,29.05 36.51,29.05 v36.2,29.37 | 27.15,33.81 C16.2 | 25.25,34.77 25.24,34.77 25.24,35.4 | C27.1
  Top 0.559: 25.24,35.4 v22.23,35.4 | 25.25,30.8 25.25,34.77 | 25.25,34.77 27.15,34.77 | 27.15,34.77 29.21,34.77 30.32,35.88 | 25.25,34.77 R12.1 | U$2.4 18.41,27.15 19.05,27.78 19.05,29.05 20.32,30.32 | C2.2 35.17,14.4 C5.2 | 33.97,13.81 32.43,13.81 | v33.66,12.22 34.29,12.86 | v26.67,24.61 27.42,24.61 | 27.15,34.77 27.15,33.81 | C27.1 v18.57,15.72 | v30.16,27.46
  Bottom 0.152: C11.2 32.34,27.1
  Bottom 0.305: 28.57,30.96 26.67,30.96 26.35,30.64
  Bottom 0.356: C26.1 24.02,30.64 v25.08,30.64 | 26.67,25.24 24.29,25.24 23.34,24.29 23.34,23.02 23.81,22.54 25.4,22.54 25.72,22.23
  Bottom 0.406: 25.46,33.5 IC1.6 | 28.09,33.03 L1.2 | 28.09,33.03 27.94,32.89 | 22.23,36.94 C15.2 | 28.57,32.54 28.09,33.03 | 28.09,33.03 | 26.35,30.64 v25.08,30.64 | 27.15,19.05 25.72,20.48 25.72,22.23 | 25.72,22.23
  Bottom 0.559: IC1.6 IC1.7 | IC1.3 22.23,34.13 v22.23,35.4 22.23,36.94 | 27.3,28.73 28.57,30 28.57,30.96 28.57,32.54 | 27.3,28.73 27.3,27.78 26.67,27.15 26.67,25.24 v26.67,24.61 | v33.66,12.22 33.66,13.18 31.59,15.24 28.57,15.24 27.15,16.67 27.15,19.05 | 27.3,28.73 26.04,27.46 21.91,27.46 17.78,23.34 17.78,16.51 v18.57,15.72 | v36.2,29.37 35.72,29.84 34.77,29.84 33.34,28.42 33.34,28.1 32.34,27.1 C11.2 30.53,27.1 v30.16,27.46
  Bottom 0.813: L1.2 25.46,33.5 | C23.2 16.38,36.99 C15.2
N$34
  Top 0.254: U$1.61 42.52,32.86
  Top 0.406: R13.2 45.08,34.18 C17.2 45.13,33.7 44.29,32.86 42.52,32.86
N$35
  Bottom 0.356: Q1.2 23.95,19.43
  Bottom 0.406: SJ12.1 26.77,10.22 26.04,10.95 26.04,17.68 Q1.2
  Bottom 0.559: 23.95,19.43 C20.2
N$36
  Top 0.254: U$1.15 32.7,26.04 35.72,26.04
  Top 0.406: R24.2 46.2,24.92 36.83,24.92 35.72,26.04
N$37
  Top 0.254: 35.4,22.38 31.27,26.51 U$1.16
  Top 0.406: 35.4,22.38 35.64,22.38 37.94,20.08 37.94,19.05 38.1,18.89 38.1,14.76 39.37,13.49 40.01,13.49 40.48,13.97 41.43,14.92 42.86,16.35 44.61,16.35 45.88,15.08 R25.2
N$38
  Bottom 0.406: C19.2 23.35,8.84 Q1.1 26.13,7.94 SJ1.1
N$39  (via drill 0.6)
  Top 0.254: 45.4,27.25 U$1.49 | v44.99,28.26 U$1.51 | 36.2,17.62 35.88,17.94 35.88,18.41 U$1.31 | 38.58,20.32 38.58,19.37 39.52,18.42 U$1.33 39.69,18.36 v39.69,16.35 | U$1.41 41.17,22.54 39.37,22.54
  Top 0.356: 39.37,22.54 38.89,22.07 38.89,21.43 38.34,20.88 38.34,20.56
  Top 0.406: 45.4,27.25 45.4,27.78 45.09,28.1 v44.99,28.26 | 36.2,17.62 36.99,17.62 v37.15,17.78 | v37.15,17.78 | 38.58,20.32 38.34,20.56 35.08,23.81 v33.66,25.24 | v42.07,11.27 41.91,10.95 JP2.21
  Top 0.559: v24.13,23.34 21.67,20.88 v21.67,20.08
  Bottom 0.254: 42.39,14.13 42.39,13.02 42.86,12.54 43.1,12.3 43.5,11.91 44.23,11.91 IC4.3
  Bottom 0.356: C20.1 19.37,21.86 19.37,21.59 | 19.92,21.03 20.16,20.8 | v24.13,23.34 25.72,23.34 | v21.67,20.08
  Bottom 0.406: IC3.1 37.68,33.5 | IC4.3 44.9,11.3 | 45.4,10.73 45.4,10.64 45.4,10.16 44.93,9.68 44.29,9.68 43.8,10.17 IC4.5 | v37.15,17.78 37.25,17.78 IC4.21 38.99,16.03 39.85,16.03 | 42.39,14.13 42.39,15.56 41.91,16.03 39.85,16.03 | v39.69,16.35 39.85,16.35 39.85,16.03 | 42.46,30.4 42.62,30.24 | 44.77,28.1 v44.99,28.26 44.93,28.19 | 25.72,23.34 26.04,23.02 27.46,23.02 28.42,23.97 31.27,23.97 32.54,25.24 v33.66,25.24 33.66,26.81 arc-90 C8.2 33.82,26.91 C10.2 35.28,28.3 35.4,28.42 | 14.61,16.5 R15.1 | 14.61,16.5 R17.1 16.52,16.5 18.1,14.92 | R15.1 | R16.1 14.61,16.5 | 14.61,16.5 | 18.1,14.92 | 18.1,14.92 18.26,14.76 18.89,14.76 19.53,15.4 19.53,19.21 19.37,19.37 | v42.07,11.27 42.86,12.06 42.86,12.54
  Bottom 0.559: IC4.3 45.4,10.73 | C19.1 21.91,12.59 21.91,19.84 v21.67,20.08 20.95,20.8 20.16,20.8 | 45.4,10.64 49.84,10.64 49.84,9.38 R29.1 49.9,9.1 C21.2 | 19.37,21.59 19.92,21.03 19.37,20.48 19.37,19.37 | 35.4,28.42 36.67,28.42 37.15,28.89 37.15,29.21 38.34,30.4
  Bottom 0.838: JP2.23 JP2.21 JP2.19
  Bottom 1.016: GROUND.MP 38.34,34.37 IC3.1 | 37.68,33.5 L1.1 | IC3.1 38.26,33.07 | IC3.1 38.34,30.4 42.46,30.4 | 44.77,28.1 42.62,30.24 44.1,30.24 C14.2 | C18.2 47.58,28.19 SJ13.3 44.93,28.19
N$40
  Bottom 0.356: IC4.7 41.93,9.68 41.59,9.68 40.96,9.05 40.96,8.1 40.16,7.3 31.59,7.3 30.8,8.1 30.8,10.48 29.53,11.75 SJ12.2
N$44
  Bottom 0.559: LED1.C R15.2
N$45
  Bottom 0.406: LED2.C
  Bottom 0.559: LED2.C R16.2
N$46
  Bottom 0.406: LED3.C
  Bottom 0.559: LED3.C R17.2
N$48
  Bottom 0.356: SJ1.2 31.08,6.67 38.89,6.67 41.27,6.67 42,7.4 IC4.8
N$57
  Top 0.559: U$2.6 C25.2
N$58
  Top 0.406: X4.4 7.63,8.1 | 10.63,3.01 R23.1
  Top 1.27: X4.5 10.63,3.01
  Top 1.778: X4.4 X4.3 X4.2 X4.5
  Bottom 1.778: 7.78,3.02 X4.2 2.54,8.1 7.62,8.1 X4.4
N$59
  Top 0.406: X3.4 7.63,16.99
  Top 1.27: 7.63,16.99 R22.1
  Top 1.778: X3.4 X3.3 X3.2 X3.5
  Bottom 1.778: X3.5 X3.2 2.54,16.99 7.62,16.99 X3.4
N$60
  Top 0.406: R24.1 51.12,24.45 51.12,26.51 52.39,27.78 59.37,27.78 60.64,26.51
  Top 0.559: 60.64,26.51 60.64,16.35 58.74,14.45 X7.1
N$63
  Top 0.406: R25.1 45.88,8.57 48.9,5.56 X8.1
N$65
  Top 0.406: X8.2 53.33,8.1
  Top 1.27: 53.33,8.1 51.59,8.1 R27.1
  Top 1.778: X8.2 X8.3 X8.4 X8.5
  Bottom 1.778: X8.5 X8.4 58.42,8.1 53.34,8.1 X8.2
N$66
  Top 0.406: X7.2 53.33,16.99
  Top 1.27: 53.33,16.99 R26.1
  Top 1.778: X7.3 X7.2 X7.5 X7.4
  Bottom 1.778: X7.4 X7.5 53.34,16.99 58.42,16.99 X7.3
PB0  (via drill 0.6)
  Top 0.254: 21.91,6.99 31.43,6.99 v32.86,8.41
  Top 0.406: v21.43,7.46 21.91,6.99
  Bottom 0.152: 37.78,9.84 38.12,10.18 IC4.12
  Bottom 0.254: v32.86,8.41 34.29,9.84 37.15,9.84 37.31,9.68 37.62,9.68 37.78,9.84
  Bottom 0.406: LED1.A 15.71,6.51 20.16,6.51 21.11,7.46 v21.43,7.46
PB1  (via drill 0.6)
  Top 0.254: 24.13,7.62 30.96,7.62 v32.86,9.53
  Top 0.406: 24.13,7.62 23.02,8.73 20.95,8.73 v19.68,7.46
  Bottom 0.152: 37.15,10.32 37.58,10.75 | 33.34,10
  Bottom 0.254: v32.86,9.53 33.34,10 33.66,10.32 37.15,10.32 | 37.58,10.75 IC4.13
  Bottom 0.406: LED3.A 16.19,7.94 16.99,7.14 18.26,7.14 18.57,7.46 v19.68,7.46
PB2  (via drill 0.6)
  Top 0.254: v31.75,9.53 30.48,8.26 24.61,8.26
  Top 0.406: v17.78,8.1 19.05,8.1 20.48,9.53 23.34,9.53 24.61,8.26
  Bottom 0.254: IC4.14 36.55,10.79 33.02,10.79 v31.75,9.53
  Bottom 0.406: LED2.A
  Bottom 0.559: v17.78,8.1 17.78,8.89 17.14,9.53 13.02,9.53 LED2.A
PD0  (via drill 0.6)
  Top 0.254: JP2.16 35.56,3.97 35.56,6.03 37.78,8.26 37.78,9.21 | 37.78,9.21 | v43.34,14.76 | v43.34,14.76 43.18,14.76 37.78,9.37 37.78,9.21
  Bottom 0.406: IC4.30 43.94,14.76 v43.34,14.76
PD1  (via drill 0.6)
  Top 0.406: v43.34,13.65 | v43.34,13.65 43.18,13.65 38.58,9.05 38.58,7.94 36.83,6.19 JP2.17
  Bottom 0.254: IC4.31 43.95,13.65 v43.34,13.65
PD2  (via drill 0.6)
  Top 0.254: v43.97,12.7 43.18,11.91 43.18,4.76 42.39,3.97 38.1,3.97 JP2.18
  Bottom 0.254: IC4.32 v43.97,12.7
PD5  (via drill 0.6)
  Top 0.254: v36.51,8.1 34.29,5.87 JP2.15
  Bottom 0.254: IC4.9 39.51,8.1 v36.51,8.1
PD6  (via drill 0.6)
  Top 0.254: v35.4,8.1 33.02,5.71 33.02,3.97 JP2.14
  Bottom 0.254: IC4.10 38.85,8.57 37.15,8.57 36.83,8.89 36.2,8.89 v35.4,8.1
PD7  (via drill 0.6)
  Top 0.254: JP2.13 34.29,7.78 v34.29,8.1
  Bottom 0.254: v34.29,8.1 35.4,9.37 36.99,9.37 37.15,9.21 38.26,9.21 38.66,9.61 IC4.11
REF_NODE
  Top 0.406: IC2.1 30.12,33.97 R11.1 32.22,34.6 C22.1 32.22,36.83 31.75,37.31 29.2,37.31 R12.2
RLD_OUT
  Top 0.254: U$1.63 U$1.62 | U$1.62 43.09,34.13
  Top 0.406: U$1.62 | 43.09,34.13 C17.1 43.18,34.18 R13.1 43.18,36.67
  Top 0.559: 43.18,36.67 44.13,37.62 46.04,37.62 47.62,36.04 RLD_OUT.1
SCLK  (via drill 0.6)
  Top 0.254: U$1.40 41.25,21.75 v39.69,21.75
  Bottom 0.356: 38.42,23.02 v39.69,21.75 | 35.4,15.1 35.38,15.1 35.24,15.24 | 35.24,15.24 | 35.08,15.4 35.08,18.26 35.4,18.57
  Bottom 0.406: 38.42,23.02 37.78,23.02 37.15,22.38 37.15,19.05 36.67,18.57 35.4,18.57
  Bottom 0.559: 35.4,15.1 IC4.17 | 35.24,15.24 35.08,15.4
START  (via drill 0.6)
  Top 0.254: U$1.38 41.9,19.68 42.55,19.68 42.7,19.84 v43.5,19.84
  Bottom 0.559: v43.5,19.84 43.36,19.84 IC4.25
UCRESET
  Bottom 0.406: R14.1 47.94,14.29 45.4,16.83 | 45.4,16.83 | IC4.29 44.87,16.83 45.4,16.83
VCC_IN
  Bottom 0.406: IC1.5 25.46,35.78 | VCC.MP 37.15,36.04 | 24.13,35.4 24.18,35.45
  Bottom 0.559: IC1.5 24.13,35.4 23.5,34.77 23.5,32.23 24.13,31.59 IC1.8 | 24.18,35.45 C15.1
  Bottom 1.016: 25.46,35.78 26.04,36.35 36.51,36.35 VCC.MP | 37.15,36.04 39.05,37.94 40.96,37.94 42.94,35.96 IC3.3 45.01,33.15 C14.1
VDD  (via drill 0.6)
  Top 0.254: 32.64,23.65 U$1.19 | 33.34,22.94 U$1.21 | 33.34,22.23 U$1.22 | 42.03,30.96 U$1.59 40.76,29.69 37.78,29.69 | U$1.54 42.71,28.1 42.23,28.1 | 42.86,30.64 42.86,29.66 U$1.56 42.42,29.24 41.91,28.73
  Top 0.356: U$2.7 21.11,29.69 v20.32,28.89 | 21.95,15.61 C27.2 | 30.21,24.92 C9.1 30.48,24.92 | v24.61,24.45 24.61,23.97 26.51,22.07 26.51,15.72 | 30.48,24.92
  Top 0.406: U$1.2 36.22,31.25 37.78,29.69 | U$1.3 U$1.4 U$1.5 U$1.6 U$1.7 U$1.8 | 33.02,23.65 32.64,23.65 | 33.02,23.65 33.34,23.34 33.34,22.94 33.34,22.23 | 27.62,30.64 27.78,30.64 27.78,31.28 C16.1 | IC2.5 29.86,31.29 29.21,30.64 | 31.75,24.92 33.02,23.65 | 42.03,30.96 42.55,30.96 42.86,30.64 | 42.23,28.1 41.91,28.42 41.91,28.73 | R11.2 34.66,33.97 | U$3.7 23.97,13.18 26.51,15.72 | 31.75,24.92 | 30.48,24.92 31.75,24.92 | C9.1 | v30.96,24.92 C9.1 | v24.61,24.45
  Top 0.559: U$1.3 U$1.2 U$1.1 34.66,33.97 | v33.34,32.07 33.7,31.71 U$1.2 | 21.95,15.61 21.11,14.76 21.11,13.65 21.59,13.18 U$3.7
  Top 1.016: 27.62,30.64 v26.99,30 | 27.78,30.64 29.21,30.64 v30.16,30.64
  Bottom 0.356: C26.2 21.38,30.16 | 20.26,31.29 IC1.1 | C26.2 21.59,30.11 21.59,29.53 | v20.32,28.89 20.32,28.94 C26.2 | 27.15,23.65 26.35,23.65 25.56,24.45 v24.61,24.45 | v26.99,30
  Bottom 0.406: IC1.2 17.73,32.86 C13.2 15.47,33.13 C23.1 | 27.15,23.65 27.62,24.13 27.62,26.83 28.26,27.46 28.26,28.42 29.37,29.53 29.37,30 30,30.64 v30.16,30.64 30.16,29.05 29.21,28.1 29.21,26.67 v30.96,24.92
  Bottom 0.559: v30.16,30.64 31.43,32.07 v33.34,32.07 33.34,30.53 C11.1
  Bottom 0.838: IC1.1 IC1.2
  Bottom 1.016: 21.38,30.16 20.26,31.29 | 21.59,29.53 22.54,28.57 25.56,28.57 v26.99,30

### Text on the board
bNames: (cc) by-sa by jaseg | OpenMind | v0.1